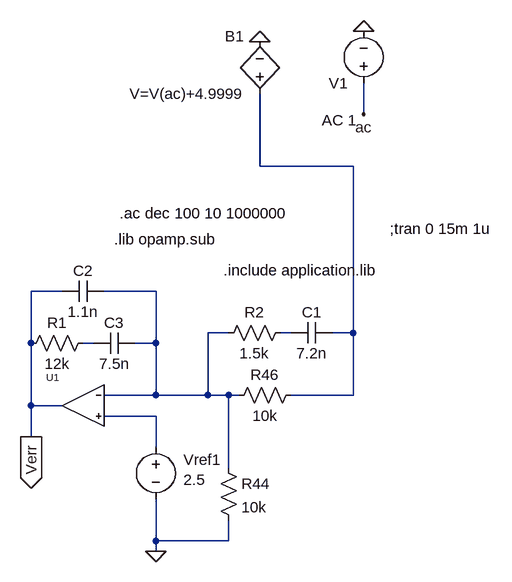
[diagram p0: schematic proof.asc]
proof.asc, the LTspice schematic file:
Version 4
SHEET 1 880 680
WIRE 400 -720 400 -768
WIRE 240 -640 240 -752
WIRE 384 -640 240 -640
WIRE -64 -448 -112 -448
WIRE 80 -448 0 -448
WIRE 192 -384 160 -384
WIRE 288 -384 272 -384
WIRE 384 -384 384 -640
WIRE 384 -384 352 -384
WIRE -112 -368 -112 -448
WIRE -16 -368 -32 -368
WIRE 80 -368 80 -448
WIRE 80 -368 48 -368
WIRE 80 -288 80 -368
WIRE 80 -288 0 -288
WIRE 160 -288 160 -384
WIRE 160 -288 80 -288
WIRE 192 -288 160 -288
WIRE 208 -288 192 -288
WIRE 384 -288 384 -384
WIRE 384 -288 288 -288
WIRE -112 -272 -112 -368
WIRE -64 -272 -112 -272
WIRE 80 -256 0 -256
WIRE -112 -224 -112 -272
WIRE 80 -208 80 -256
WIRE 192 -176 192 -288
WIRE 80 -64 80 -128
WIRE 192 -64 192 -96
WIRE 192 -64 80 -64
WIRE 80 -48 80 -64
FLAG 80 -48 0
FLAG -112 -224 Verr
IOPIN -112 -224 Out
FLAG 240 -832 0
FLAG 400 -848 0
FLAG 400 -720 ac
SYMBOL res 176 -192 R0
SYMATTR InstName R44
SYMATTR Value 10k
SYMBOL res 304 -304 R90
WINDOW 0 0 56 VBottom 0
WINDOW 3 32 56 VTop 0
SYMATTR InstName R46
SYMATTR Value 10k
SYMBOL voltage 80 -224 R0
WINDOW 0 43 35 Left 0
WINDOW 3 43 66 Left 0
WINDOW 123 0 0 Left 0
WINDOW 39 0 0 Left 0
SYMATTR InstName Vref1
SYMATTR Value 2.5
SYMBOL cap 0 -464 R90
WINDOW 0 0 32 VBottom 0
WINDOW 3 32 32 VTop 0
SYMATTR InstName C2
SYMATTR Value 1.1n
SYMBOL res -16 -384 R90
WINDOW 0 0 56 VBottom 0
WINDOW 3 32 56 VTop 0
SYMATTR InstName R1
SYMATTR Value 12k
SYMBOL cap -16 -352 R270
WINDOW 0 32 32 VTop 0
WINDOW 3 0 32 VBottom 0
SYMATTR InstName C3
SYMATTR Value 7.5n
SYMBOL res 288 -400 R90
WINDOW 0 0 56 VBottom 0
WINDOW 3 32 56 VTop 0
SYMATTR InstName R2
SYMATTR Value 1.5k
SYMBOL cap 288 -368 R270
WINDOW 0 32 32 VTop 0
WINDOW 3 0 32 VBottom 0
SYMATTR InstName C1
SYMATTR Value 7.2n
SYMBOL ampsimp -32 -272 M0
SYMATTR InstName U1
SYMBOL voltage 400 -752 R180
WINDOW 123 11 -41 Left 0
WINDOW 39 0 0 Left 0
WINDOW 3 11 -13 Left 0
SYMATTR Value2 AC 1
SYMATTR Value ""
SYMATTR InstName V1
SYMBOL bv 240 -736 R180
WINDOW 0 24 104 Left 0
WINDOW 3 24 16 Left 0
SYMATTR InstName B1
SYMATTR Value V=V(ac)+4.9999
TEXT 24 -568 Left 0 !.ac dec 100 10 1000000
TEXT 184 -480 Left 0 !.include application.lib
TEXT 440 -544 Left 0 !;tran 0 15m 1u
TEXT 16 -528 Left 0 !.lib opamp.sub

The netlist it stands for:
* proof.asc
R44 N002 0 10k
R46 N001 N002 10k
Vref1 N005 0 2.5
C2 N002 Verr 1.1n
R1 N004 Verr 12k
C3 N004 N002 7.5n
R2 N003 N002 1.5k
C1 N003 N001 7.2n
XU1 N005 N002 Verr AMPSIMP POLE=30 GAIN=30000 VHIGH=4V VLOW=100mV  ; pins In+ In- OUT
V1 ac 0 AC 1
B1 N001 0 V=V(ac)+4.9999
.ac dec 100 10 1000000
.include application.lib
;tran 0 15m 1u
.lib opamp.sub
.backanno
.end